# Altium schematic sheet Cover.SchDoc: **
size A3; Date: 07.08.2025; CheckedBy: Own Check; CompanyName: No Company; DocumentNumber: ELK.PCB.0005.0005.A.A; Revision: V0.0.1; SheetNumber: 1; SheetTotal: 22
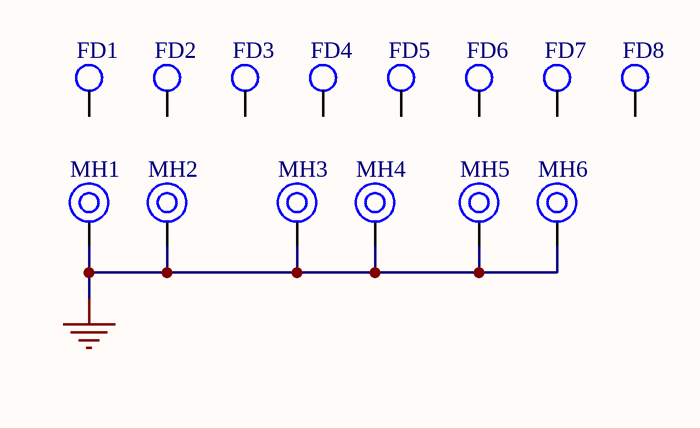
[diagram p0: Cover.SchDoc]

## Parts
FD1  Fiducial  [FIDUCIAL_50MIL]  (value not drawn)
FD2  Fiducial  [FIDUCIAL_50MIL]  (value not drawn)
FD3  Fiducial  [FIDUCIAL_50MIL]  (value not drawn)
FD4  Fiducial  [FIDUCIAL_50MIL]  (value not drawn)
FD5  Fiducial  [FIDUCIAL_50MIL]  (value not drawn)
FD6  Fiducial  [FIDUCIAL_50MIL]  (value not drawn)
FD7  Fiducial  [FIDUCIAL_50MIL]  (value not drawn)
FD8  Fiducial  [FIDUCIAL_50MIL]  (value not drawn)
MH1  Mounting Hole  [SOM_Mounting]  (value not drawn)  (no BOM)
MH2  Mounting Hole  [SOM_Mounting]  (value not drawn)  (no BOM)
MH3  Mounting Hole  [SOM_Mounting]  (value not drawn)  (no BOM)
MH4  Mounting Hole  [SOM_Mounting]  (value not drawn)  (no BOM)
MH5  Mounting Hole  [SOM_Mounting]  (value not drawn)  (no BOM)
MH6  Mounting Hole  [SOM_Mounting]  (value not drawn)  (no BOM)

## Nets
GND: MH1.1 MH2.1 MH3.1 MH4.1 MH5.1 MH6.1

Not connected (* = marked no-connect by the designer): FD1 1; FD2 1; FD3 1; FD4 1; FD5 1; FD6 1; FD7 1; FD8 1

## Notes on the sheet
- Title
- Company
- Product Number
- Subtitle
- Project Revision Date
- Template Revision Date
- Project Revision
- Template Revision
- Size
- Page
- A3
- Total
- Checked By
- Drawn By
- 22.07.2025
- Talha ÇETİNCEVİZ
- A

## Library data of the parts
FD1-FD8 = Fiducials: 78.7 or 50 mil Fiducials SMD; Manufacturer: NA; Manufacturer Part Number: NA; Case/Package: SMD; Supplier-1: NA; Supplier Part Number-1: NA; Alternate Part Number-1: NA; Category: Fiducial; Number of Pins: 1
MH1-MH6 = MH_3.5H_6D: Manufacturer Part Number: NA; Case/Package: TH; Manufacturer: NA; Supplier-1: NA